# EAGLE schematic IO (EAGLE 7.4.0)

## Sheet 1 of 2
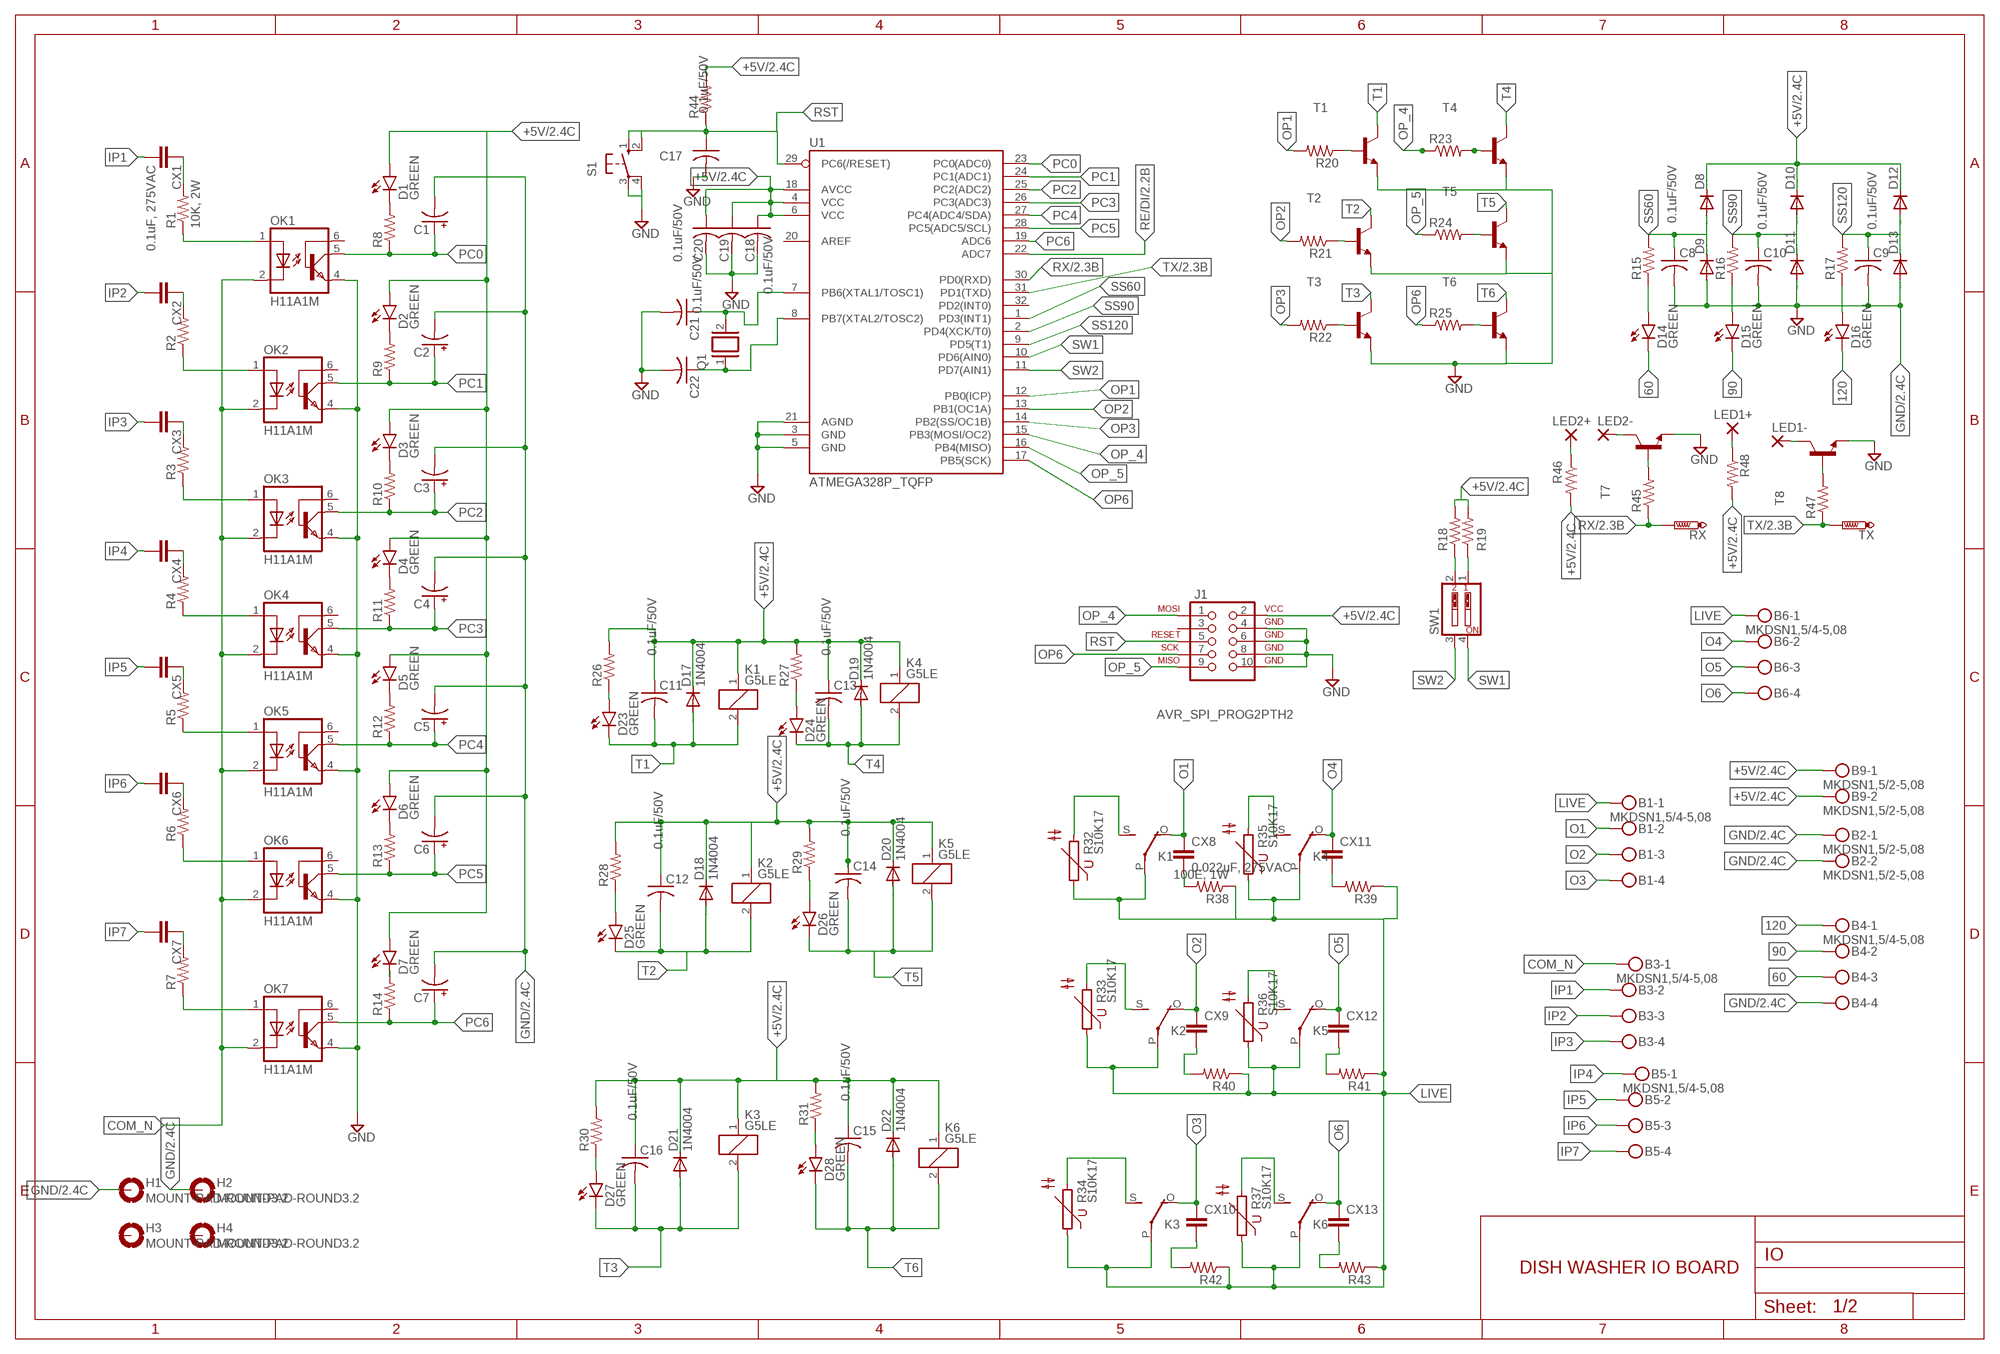
[diagram p0: schematic, sheet 1]

### Parts
B1  MKDSN1,5/4-5,08  [MKDSN1,5/4-5,08]
B2  MKDSN1,5/2-5,08  [MKDSN1,5/2-5,08]
B3  MKDSN1,5/4-5,08  [MKDSN1,5/4-5,08]
B4  MKDSN1,5/4-5,08  [MKDSN1,5/4-5,08]
B5  MKDSN1,5/4-5,08  [MKDSN1,5/4-5,08]
B6  MKDSN1,5/4-5,08  [MKDSN1,5/4-5,08]
B9  MKDSN1,5/2-5,08  [MKDSN1,5/2-5,08]
C1  CPOL-USSMCC  [SMC_C]
C2  CPOL-USSMCC  [SMC_C]
C3  CPOL-USSMCC  [SMC_C]
C4  CPOL-USSMCC  [SMC_C]
C5  CPOL-USSMCC  [SMC_C]
C6  CPOL-USSMCC  [SMC_C]
C7  CPOL-USSMCC  [SMC_C]
C8  0.1uF/50V  C-USC0805K  [C0805K]
C9  0.1uF/50V  C-USC0805K  [C0805K]
C10  0.1uF/50V  C-USC0805K  [C0805K]
C11  0.1uF/50V  C-USC0805K  [C0805K]
C12  0.1uF/50V  C-USC0805K  [C0805K]
C13  0.1uF/50V  C-USC0805K  [C0805K]
C14  0.1uF/50V  C-USC0805K  [C0805K]
C15  0.1uF/50V  C-USC0805K  [C0805K]
C16  0.1uF/50V  C-USC0805K  [C0805K]
C17  0.1uF/50V  C-USC0805K  [C0805K]
C18  0.1uF/50V  C-USC0805K  [C0805K]
C19  0.1uF/50V  C-USC0805K  [C0805K]
C20  0.1uF/50V  C-USC0805K  [C0805K]
C21  C-USC0603K  [C0603K]
C22  C-USC0603K  [C0603K]
CX1  0.1uF, 275VAC  CXXC15B8  [XC15B8]
CX2  CXXC15B8  [XC15B8]
CX3  CXXC15B8  [XC15B8]
CX4  CXXC15B8  [XC15B8]
CX5  CXXC15B8  [XC15B8]
CX6  CXXC15B8  [XC15B8]
CX7  CXXC15B8  [XC15B8]
CX8  0.022uF, 275VAC  CXXC10B5  [XC10B5]
CX9  CXXC10B5  [XC10B5]
CX10  CXXC10B5  [XC10B5]
CX11  CXXC10B5  [XC10B5]
CX12  CXXC10B5  [XC10B5]
CX13  CXXC10B5  [XC10B5]
D1  GREEN  LED-GREEN1206  [LED-1206]
D2  GREEN  LED-GREEN1206  [LED-1206]
D3  GREEN  LED-GREEN1206  [LED-1206]
D4  GREEN  LED-GREEN1206  [LED-1206]
D5  GREEN  LED-GREEN1206  [LED-1206]
D6  GREEN  LED-GREEN1206  [LED-1206]
D7  GREEN  LED-GREEN1206  [LED-1206]
D8  1N4148DO35-10  [DO35-10]
D9  1N4148DO35-10  [DO35-10]
D10  1N4148DO35-10  [DO35-10]
D11  1N4148DO35-10  [DO35-10]
D12  1N4148DO35-10  [DO35-10]
D13  1N4148DO35-10  [DO35-10]
D14  GREEN  LED-GREEN1206  [LED-1206]
D15  GREEN  LED-GREEN1206  [LED-1206]
D16  GREEN  LED-GREEN1206  [LED-1206]
D17  1N4004  [DO41-10]
D18  1N4004  [DO41-10]
D19  1N4004  [DO41-10]
D20  1N4004  [DO41-10]
D21  1N4004  [DO41-10]
D22  1N4004  [DO41-10]
D23  GREEN  LED-GREEN1206  [LED-1206]
D24  GREEN  LED-GREEN1206  [LED-1206]
D25  GREEN  LED-GREEN1206  [LED-1206]
D26  GREEN  LED-GREEN1206  [LED-1206]
D27  GREEN  LED-GREEN1206  [LED-1206]
D28  GREEN  LED-GREEN1206  [LED-1206]
H1  MOUNT-PAD-ROUND3.2  [3,2-PAD]
H2  MOUNT-PAD-ROUND3.2  [3,2-PAD]
H3  MOUNT-PAD-ROUND3.2  [3,2-PAD]
H4  MOUNT-PAD-ROUND3.2  [3,2-PAD]
J1  AVR_SPI_PROG2PTH2  [2X5-SHROUDED]
K1  G5LE  [G5LE]
K2  G5LE  [G5LE]
K3  G5LE  [G5LE]
K4  G5LE  [G5LE]
K5  G5LE  [G5LE]
K6  G5LE  [G5LE]
LED1+  2,54/1,0  [2,54/1,0]
LED1-  2,54/1,0  [2,54/1,0]
LED2+  2,54/1,0  [2,54/1,0]
LED2-  2,54/1,0  [2,54/1,0]
OK1  H11A1M  [DIL06]
OK2  H11A1M  [DIL06]
OK3  H11A1M  [DIL06]
OK4  H11A1M  [DIL06]
OK5  H11A1M  [DIL06]
OK6  H11A1M  [DIL06]
OK7  H11A1M  [DIL06]
Q1  XTAL/S  [QS]
R1  10K, 2W  R-US_0617/22  [0617/22]
R2  R-US_0617/22  [0617/22]
R3  R-US_0617/22  [0617/22]
R4  R-US_0617/22  [0617/22]
R5  R-US_0617/22  [0617/22]
R6  R-US_0617/22  [0617/22]
R7  R-US_0617/22  [0617/22]
R8  R-US_R0805  [R0805]
R9  R-US_R0805  [R0805]
R10  R-US_R0805  [R0805]
R11  R-US_R0805  [R0805]
R12  R-US_R0805  [R0805]
R13  R-US_R0805  [R0805]
R14  R-US_R0805  [R0805]
R15  R-US_R0805  [R0805]
R16  R-US_R0805  [R0805]
R17  R-US_R0805  [R0805]
R18  R-US_R0805  [R0805]
R19  R-US_R0805  [R0805]
R20  R-US_R0805  [R0805]
R21  R-US_R0805  [R0805]
R22  R-US_R0805  [R0805]
R23  R-US_R0805  [R0805]
R24  R-US_R0805  [R0805]
R25  R-US_R0805  [R0805]
R26  R-US_R0805  [R0805]
R27  R-US_R0805  [R0805]
R28  R-US_R0805  [R0805]
R29  R-US_R0805  [R0805]
R30  R-US_R0805  [R0805]
R31  R-US_R0805  [R0805]
R32  S10K17  [S10K17]
R33  S10K17  [S10K17]
R34  S10K17  [S10K17]
R35  S10K17  [S10K17]
R36  S10K17  [S10K17]
R37  S10K17  [S10K17]
R38  100E, 1W  R-US_0411/15  [0411/15]
R39  R-US_0411/15  [0411/15]
R40  R-US_0411/15  [0411/15]
R41  R-US_0411/15  [0411/15]
R42  R-US_0411/15  [0411/15]
R43  R-US_0411/15  [0411/15]
R44  R-US_R0805  [R0805]
R45  R-US_R0805  [R0805]
R46  R-US_R0805  [R0805]
R47  R-US_R0805  [R0805]
R48  R-US_R0805  [R0805]
RX  PTR1B1,27  [B1,27]
S1  10-XX  [B3F-10XX]
SW1  SW_DIP-2  [EDG-02]
T1  MMBT2222ALT1-NPN-SOT23-BEC  [SOT23-BEC]
T2  MMBT2222ALT1-NPN-SOT23-BEC  [SOT23-BEC]
T3  MMBT2222ALT1-NPN-SOT23-BEC  [SOT23-BEC]
T4  MMBT2222ALT1-NPN-SOT23-BEC  [SOT23-BEC]
T5  MMBT2222ALT1-NPN-SOT23-BEC  [SOT23-BEC]
T6  MMBT2222ALT1-NPN-SOT23-BEC  [SOT23-BEC]
T7  MMBT2222ALT1-NPN-SOT23-BEC  [SOT23-BEC]
T8  MMBT2222ALT1-NPN-SOT23-BEC  [SOT23-BEC]
TX  PTR1B1,27  [B1,27]
U1  ATMEGA328P_TQFP  [TQFP32-08]

### Nets
60: B4.3 D14.C
90: B4.2 D15.C
120: B4.1 D16.C
+5V: B9.1 B9.2 C11.1 C12.1 C13.1 C14.1 C15.1 C16.1 C18.1 C19.1 C20.1 D1.A D2.A D3.A D4.A D5.A D6.A D7.A D8.C D10.C D12.C D17.C D18.C D19.C D20.C D21.C D22.C J1.2(VCC) K1.1 K2.1 K3.1 K4.1 K5.1 K6.1 R18.2 R19.2 R26.2 R27.2 R28.2 R29.2 R30.2 R31.2 R44.2 R46.2 R48.2 U1.4(VCC) U1.6(VCC) U1.18(AVCC) ; also sheet 2
COM_N: B3.1 OK1.2(C) OK2.2(C) OK3.2(C) OK4.2(C) OK5.2(C) OK6.2(C) OK7.2(C)
GND: B2.1 B2.2 B4.4 C1.- C2.- C3.- C4.- C5.- C6.- C7.- C8.2 C9.2 C10.2 C17.2 C18.2 C19.2 C20.2 C21.2 C22.2 D9.A D11.A D13.A H1.B3,2(MOUNT) H2.B3,2(MOUNT) J1.4(GND) J1.6(GND) J1.8(GND) J1.10(GND) OK1.4(EMI) OK2.4(EMI) OK3.4(EMI) OK4.4(EMI) OK5.4(EMI) OK6.4(EMI) OK7.4(EMI) S1.3(P) S1.4(P1) T1.E T2.E T3.E T4.E T5.E T6.E T7.E T8.E U1.3(GND) U1.5(GND) U1.21(AGND) ; also sheet 2
IP1: B3.2 CX1.2
IP2: B3.3 CX2.2
IP3: B3.4 CX3.2
IP4: B5.1 CX4.2
IP5: B5.2 CX5.2
IP6: B5.3 CX6.2
IP7: B5.4 CX7.2
LIVE: B1.1 B6.1 K1.P(2:P) K2.P(2:P) K3.P(2:P) K4.P(2:P) K5.P(2:P) K6.P(2:P) R32.1 R33.1 R34.1 R35.1 R36.1 R37.1 R38.1 R39.1 R40.1 R41.1 R42.1 R43.1
N$1: OK1.1(A) R1.1
N$2: CX1.1 R1.2
N$3: CX2.1 R2.2
N$4: OK2.1(A) R2.1
N$5: CX3.1 R3.2
N$6: OK3.1(A) R3.1
N$7: CX4.1 R4.2
N$8: OK4.1(A) R4.1
N$9: CX5.1 R5.2
N$10: CX6.1 R6.2
N$11: OK5.1(A) R5.1
N$12: OK6.1(A) R6.1
N$13: CX7.1 R7.2
N$14: OK7.1(A) R7.1
N$15: D1.C R8.2
N$16: D2.C R9.2
N$17: D3.C R10.2
N$18: D4.C R11.2
N$19: D5.C R12.2
N$20: D6.C R13.2
N$21: D7.C R14.2
N$22: R45.2 T7.B
N$23: R47.2 T8.B
N$24: R20.1 T1.B
N$25: LED2+.1(P) R46.1
N$26: R18.1 SW1.2
N$27: R19.1 SW1.1
N$28: R21.1 T2.B
N$29: D14.A R15.1
N$30: D15.A R16.1
N$31: D16.A R17.1
N$32: R22.1 T3.B
N$33: R23.2 T4.B
N$34: R24.2 T5.B
N$35: R25.2 T6.B
N$36: LED2-.1(P) T7.C
N$37: D27.A R30.1
N$38: D23.A R26.1
N$39: K1.S(2:S) R32.2
N$40: CX8.2 R38.2
N$41: D24.A R27.1
N$42: D26.A R29.1
N$43: D25.A R28.1
N$44: K4.S(2:S) R35.2
N$45: CX11.2 R39.2
N$46: K2.S(2:S) R33.2
N$47: D28.A R31.1
N$48: CX9.2 R40.2
N$49: CX12.2 R41.2
N$50: K5.S(2:S) R36.2
N$51: CX10.2 R42.2
N$52: K3.S(2:S) R34.2
N$53: CX13.2 R43.2
N$54: K6.S(2:S) R37.2
N$55: C21.1 Q1.2 U1.7(PB6(XTAL1/TOSC1))
N$56: LED1+.1(P) R48.1
N$57: C22.1 Q1.1 U1.8(PB7(XTAL2/TOSC2))
N$58: LED1-.1(P) T8.C
O1: B1.2 CX8.1 K1.O(2:O)
O2: B1.3 CX9.1 K2.O(2:O)
O3: B1.4 CX10.1 K3.O(2:O)
O4: B6.2 CX11.1 K4.O(2:O)
O5: B6.3 CX12.1 K5.O(2:O)
O6: B6.4 CX13.1 K6.O(2:O)
OP1: R20.2 U1.12(PB0(ICP))
OP2: R21.2 U1.13(PB1(OC1A))
OP3: R22.2 U1.14(PB2(SS/OC1B))
OP6: J1.7(SCK) R25.1 U1.17(PB5(SCK))
OP_4: J1.1(MOSI) R23.1 U1.15(PB3(MOSI/OC2))
OP_5: J1.9(MISO) R24.1 U1.16(PB4(MISO))
PC0: C1.+ OK1.5(COL) R8.1 U1.23(PC0(ADC0))
PC1: C2.+ OK2.5(COL) R9.1 U1.24(PC1(ADC1))
PC2: C3.+ OK3.5(COL) R10.1 U1.25(PC2(ADC2))
PC3: C4.+ OK4.5(COL) R11.1 U1.26(PC3(ADC3))
PC4: C5.+ OK5.5(COL) R12.1 U1.27(PC4(ADC4/SDA))
PC5: C6.+ OK6.5(COL) R13.1 U1.28(PC5(ADC5/SCL))
PC6: C7.+ OK7.5(COL) R14.1 U1.19(ADC6)
RE/DI: U1.22(ADC7) ; also sheet 2
RST: C17.1 J1.5(RESET) R44.1 S1.1(S) S1.2(S1) U1.29(PC6(/RESET))
RX: R45.1 RX.TP U1.30(PD0(RXD)) ; also sheet 2
SS60: C8.1 D8.A D9.C R15.2 U1.1(PD3(INT1))
SS90: C10.1 D10.A D11.C R16.2 U1.2(PD4(XCK/T0))
SS120: C9.1 D12.A D13.C R17.2 U1.9(PD5(T1))
SW1: SW1.4 U1.10(PD6(AIN0))
SW2: SW1.3 U1.11(PD7(AIN1))
T1: C11.2 D17.A D23.C K1.2 T1.C
T2: C12.2 D18.A D25.C K2.2 T2.C
T3: C16.2 D21.A D27.C K3.2 T3.C
T4: C13.2 D19.A D24.C K4.2 T4.C
T5: C14.2 D20.A D26.C K5.2 T5.C
T6: C15.2 D22.A D28.C K6.2 T6.C
TX: R47.1 TX.TP U1.31(PD1(TXD)) ; also sheet 2
Unconnected: H3.B3,2(MOUNT) H4.B3,2(MOUNT) J1.3(NC) OK1.6(BAS) OK2.6(BAS) OK3.6(BAS) OK4.6(BAS) OK5.6(BAS) OK6.6(BAS) OK7.6(BAS) U1.20(AREF) U1.32(PD2(INT0))

### Notes on the sheet
- DISH WASHER IO BOARD

## Sheet 2 of 2
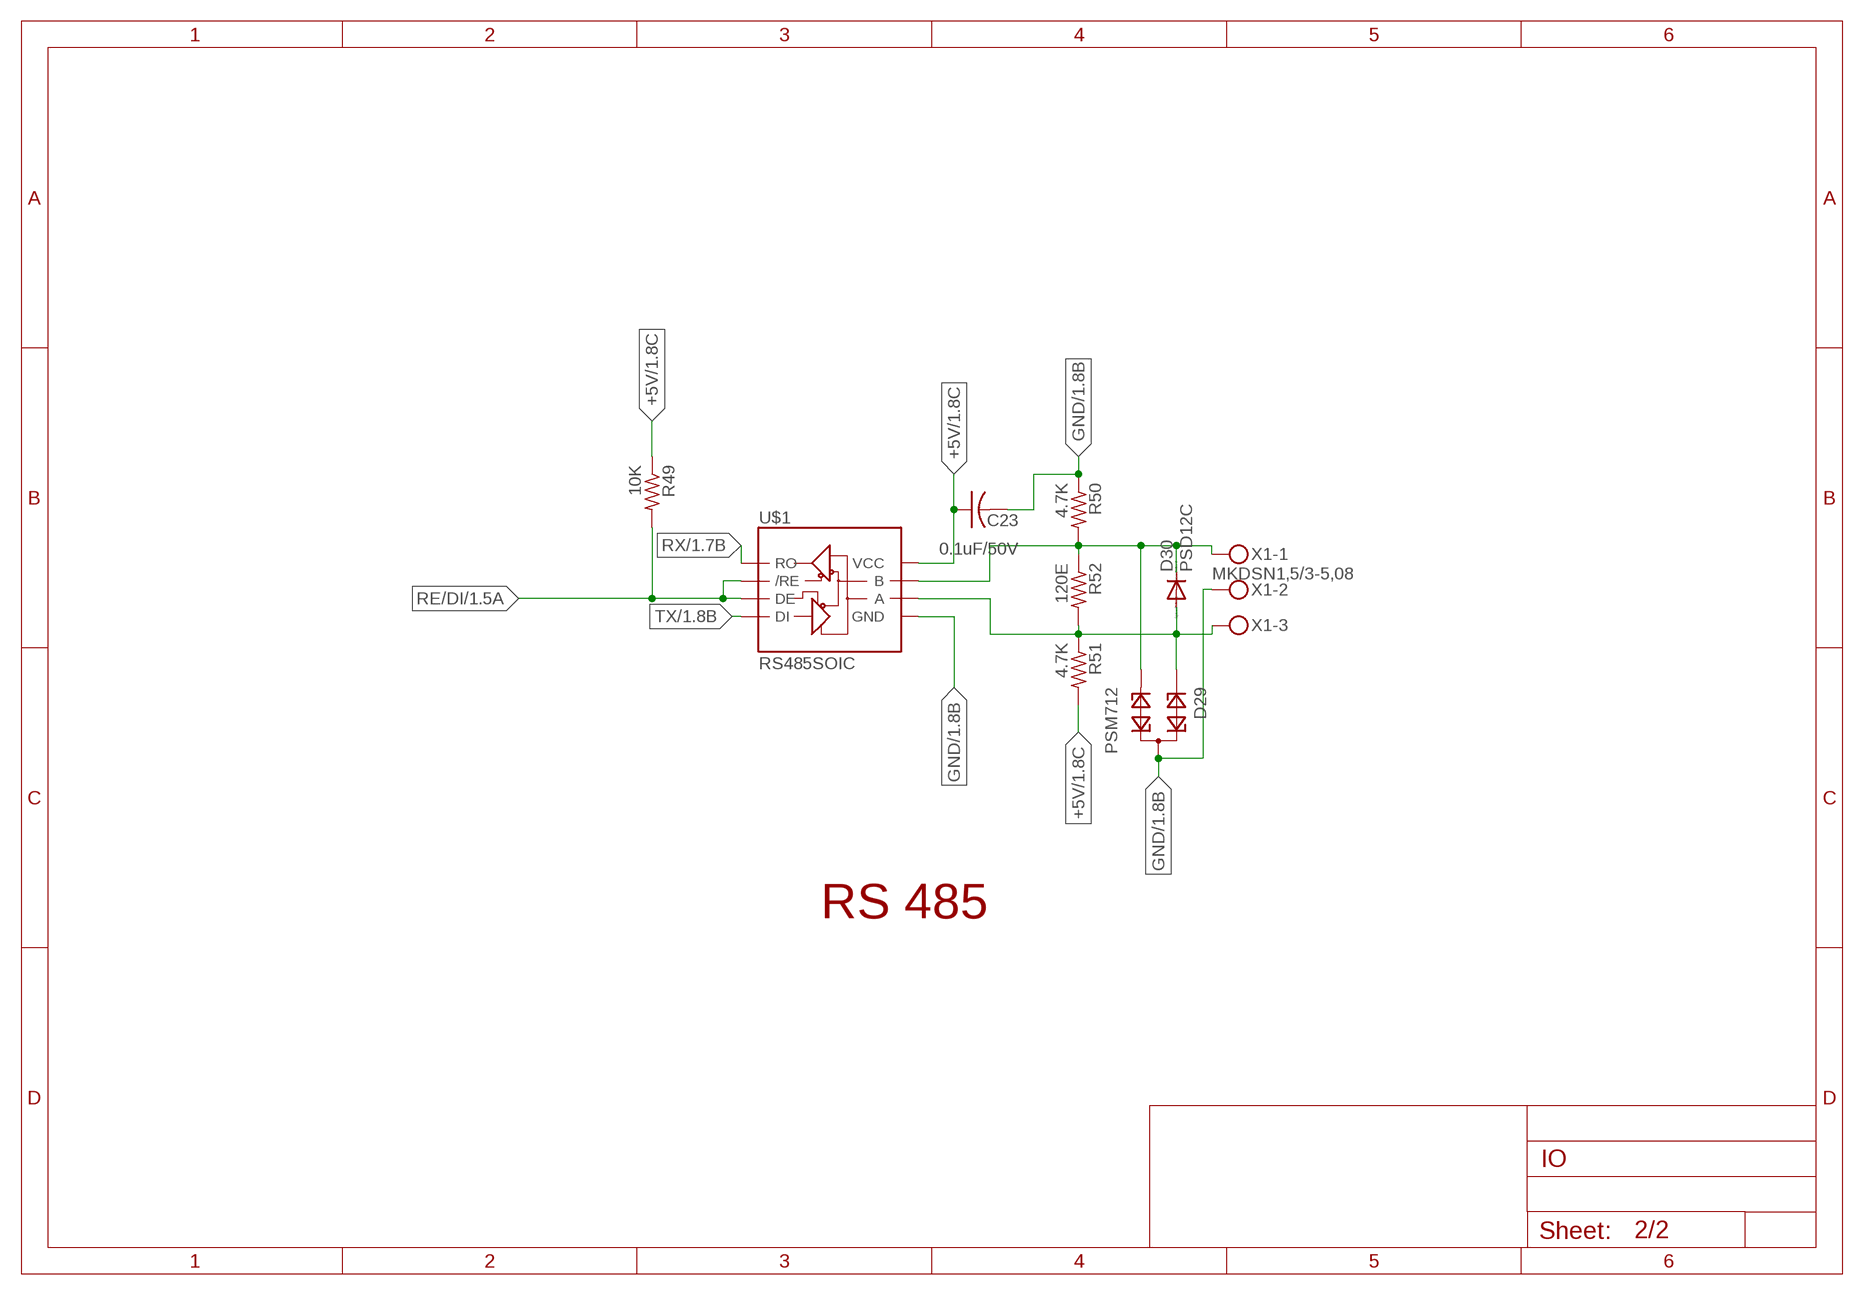
[diagram p1: schematic, sheet 2]

### Parts
C23  0.1uF/50V  C-USC0805K  [C0805K]
D29  PSM712  PESD1CAN  [SOT23]
D30  PSD12C  S1M  [SMA]
R49  10K  R-US_R0603  [R0603]
R50  4.7K  R-US_R0603  [R0603]
R51  4.7K  R-US_R0603  [R0603]
R52  120E  R-US_R0805  [R0805]
U$1  RS485SOIC  [SO08]
X1  MKDSN1,5/3-5,08  [MKDSN1,5/3-5,08]

### Nets
+5V: C23.1 R49.1 R51.2 U$1.8(VCC) ; also sheet 1
GND: C23.2 D29.3 R50.1 U$1.5(GND) X1.2 ; also sheet 1
N$62: D29.2 D30.C R50.2 R52.1 U$1.7(B) X1.1
N$63: D29.1 D30.A R51.1 R52.2 U$1.6(A) X1.3
RE/DI: R49.2 U$1.2(/RE) U$1.3(DE) ; also sheet 1
RX: U$1.1(RO) ; also sheet 1
TX: U$1.4(DI) ; also sheet 1

### Notes on the sheet
- RS 485

## Library data of the parts
B1 B3-B6 = con-phoenix-508:MKDSN1,5/4-5,08: MKDSN 1,5/ 4-5,08 Printklemme Nennstrom: 13,5 A Nennspannung: 250 V Rastermaß: 5,08 mm Polzahl: 4 Anschlussart: Schraubanschluss Montage: Löten Anschlussrichtung Leiter/Platine: 0 ° Artikelnummer: 1729144 Source: http://eshop.phoenixcontact.com .. 1729144.pdf
B2 B9 = con-phoenix-508:MKDSN1,5/2-5,08: MKDSN 1,5/ 2-5,08 Printklemme Nennstrom: 13,5 A Nennspannung: 250 V Rastermaß: 5,08 mm Polzahl: 2 Anschlussart: Schraubanschluss Montage: Löten Anschlussrichtung Leiter/Platine: 0 ° Artikelnummer: 1729128 Source: http://eshop.phoenixcontact.com .. 1729128.pdf
C1-C7 = rcl:CPOL-US: POLARIZED CAPACITOR, American symbol
C8-C23 = rcl:C-US: CAPACITOR, American symbol
CX1-CX13 = rcl:CX: X CAPACITOR for power line
D1-D7 D14-D16 D23-D28 = SparkFun-LED:LED-GREEN: Various green LEDs Green LEDs used in SFE Production 0603- DIO-00821 LARGE- DIO-00862 LILYPAD- DIO-09910; PROD_ID: DIO-00862
D8-D13 = diode:1N4148: DIODE high speed (Philips)
D17-D22 = diode:1N4004: DIODE general purpose rectifier, 1 A
D29 = diode:PESD1CAN: CAN bus ESD protection diode Source: http://www.nxp.com/documents/data_sheet/PESD1CAN.pdf
D30 = diode:S1M
H1-H4 = holes:MOUNT-PAD-ROUND: MOUNTING PAD, round
J1 = SparkFun-Connectors:AVR_SPI_PROG2: AVR 10-pin ICSP Header This is the standard AVR In Circuit Serial Programming header. Minimal, but includes pin one indicator. Works with standard Olimex programmers. Also look for the 6-pin reduced version. Spark Fun Electronics SKU: PRT-00778
K1-K6 = relay:G5LE: RELAY 1 x switch, 10 A/120 V AC, 8 A/30 V DC, Omron; OC_FARNELL: unknown; OC_NEWARK: unknown
LED1+ LED1- LED2+ LED2- = wirepad:2,54/1,0: THROUGH-HOLE PAD
OK1-OK7 = optocoupler:H11A*?M: General Purpose 6-Pin Phototransistor Optocouplers Source: http://www.fairchildsemi.com/ds/4N/4N35-M.pdf; MPN: H11A1-M; OC_FARNELL: 1021358; OC_NEWARK: 97K1793
Q1 = special:XTAL/S: CRYSTAL
R1-R31 R38-R52 = rcl:R-US_: RESISTOR, American symbol
R32-R37 = varistor:S10K17: VARISTOR
RX TX = testpad:PTR1: TEST PIN
S1 = switch-omron:10-XX: OMRON SWITCH; MPN: B3F-1000; OC_FARNELL: 176432; OC_NEWARK: 36M3542
SW1 = special:SW_DIP-2: DIP SWITCH
T1-T8 = transistor:*-NPN-: NPN Transistror BF959 corrected 2008.03.06
U1 = SparkFun-DigitalIC:ATMEGA328P_TQFP; PROD_ID: IC-09069
U$1 = SparkFun-DigitalIC:RS485: RS485 transceiver
X1 = con-phoenix-508:MKDSN1,5/3-5,08: MKDSN 1,5/ 3-5,08 Printklemme Nennstrom: 13,5 A Nennspannung: 250 V Rastermaß: 5,08 mm Polzahl: 3 Anschlussart: Schraubanschluss Montage: Löten Anschlussrichtung Leiter/Platine: 0 ° Artikelnummer: 1729131 Source: http://eshop.phoenixcontact.com .. 1729131.pdf

## Net classes
2 gnd: width 0.305 mm, drill 0.559 mm, clearance 0.254 mm